# EAGLE design MJU (EAGLE 6.4)
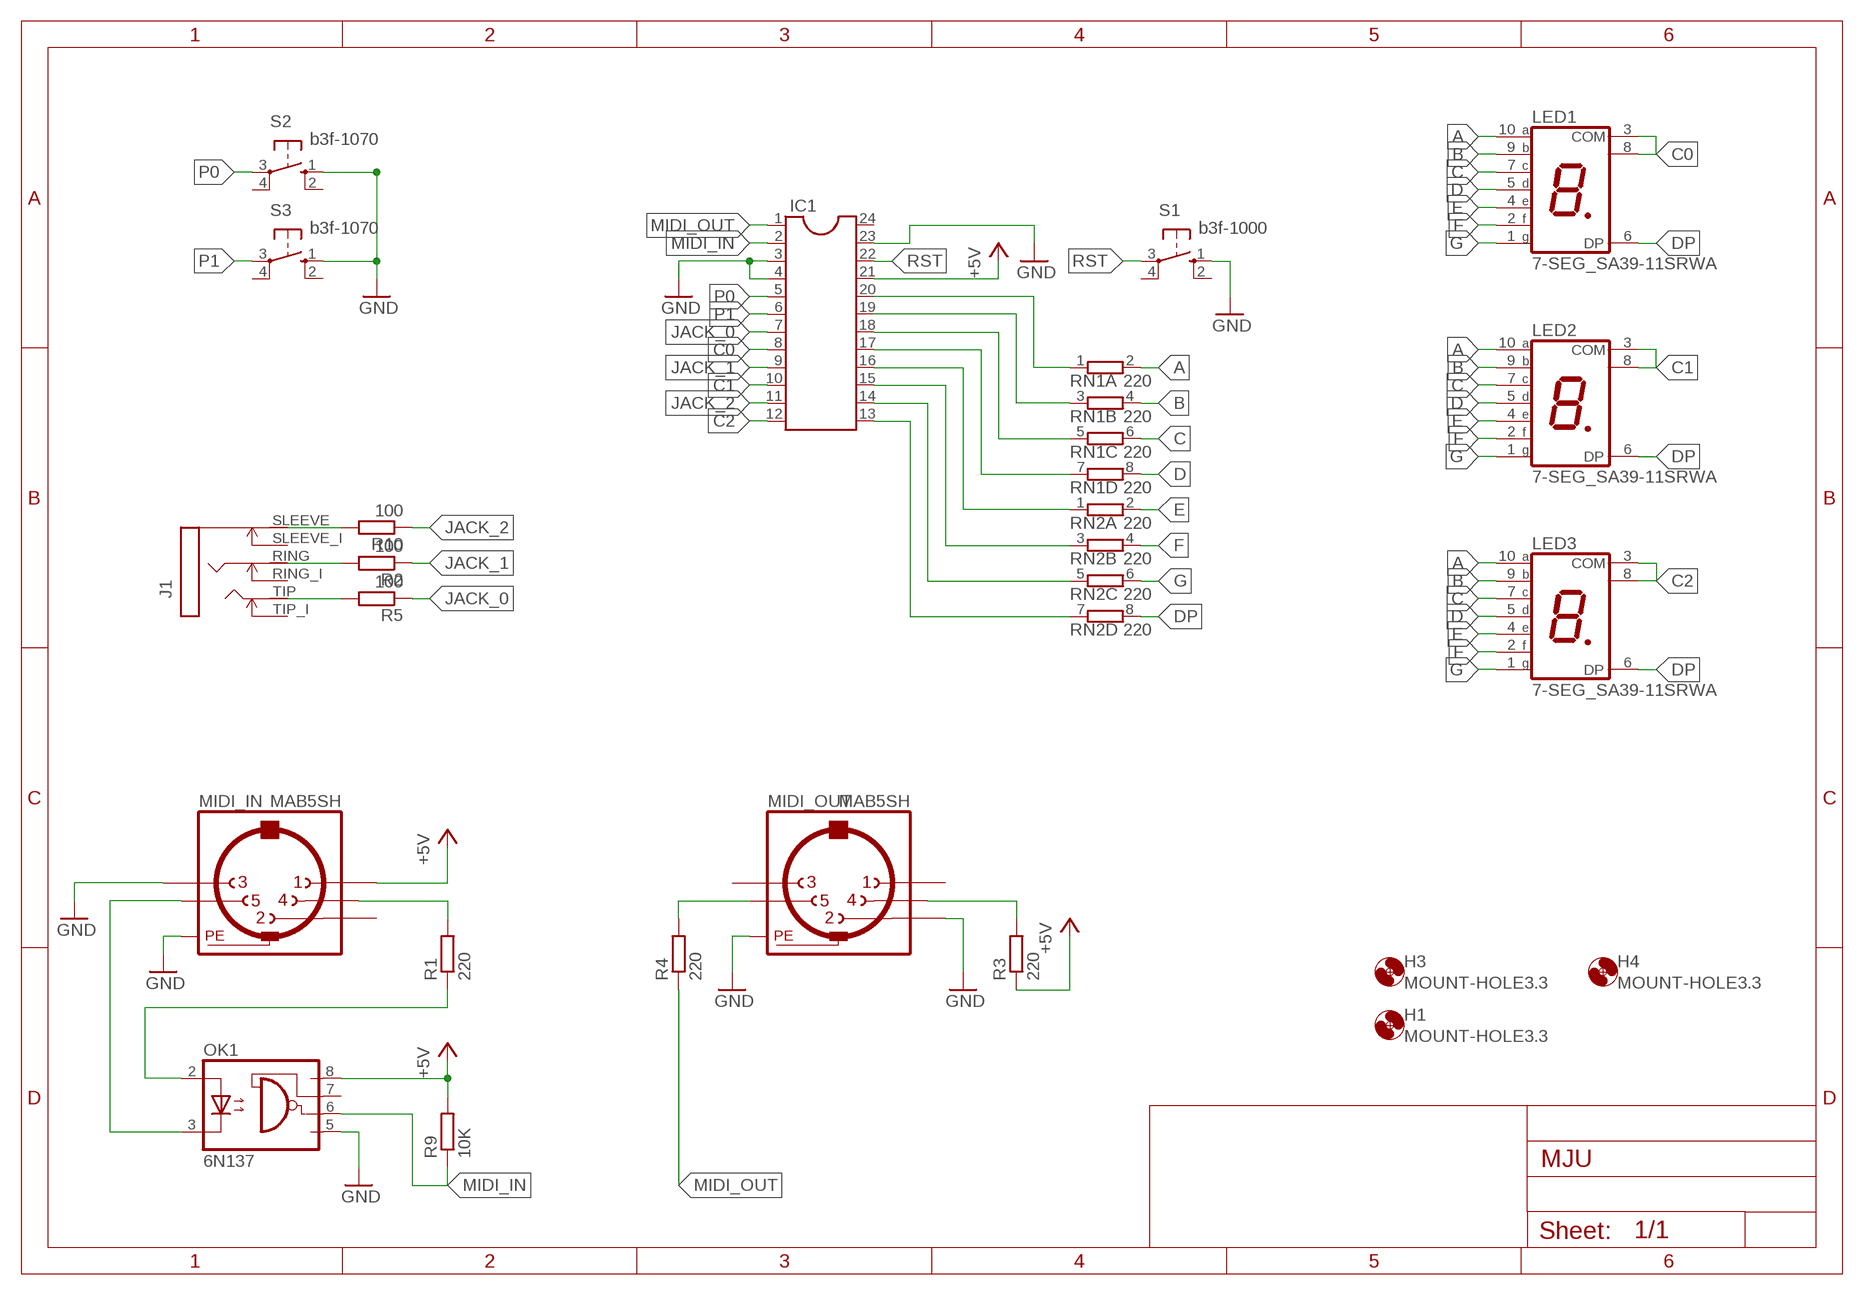
[diagram p0: schematic, sheet 1]

## Parts
H1  MOUNT-HOLE3.3  [3,3]
H3  MOUNT-HOLE3.3  [3,3]
H4  MOUNT-HOLE3.3  [3,3]
IC1  DIL24-6  [DIL24-6]
J1  STEREOSWJACK_ST_TRS_INT  [ST_JACK_TRS_INT]
LED1  7-SEG_SA39-11SRWA  [SA39-11SRWA]
LED2  7-SEG_SA39-11SRWA  [SA39-11SRWA]
LED3  7-SEG_SA39-11SRWA  [SA39-11SRWA]
MIDI_IN  MAB5SH  [MAB5SH]
MIDI_OUT  MAB5SH  [MAB5SH]
OK1  6N137  [DIL08]
R1  220  R-EU_0207/7  [0207/7]
R2  100  R-EU_0207/7  [0207/7]
R3  220  R-EU_0207/7  [0207/7]
R4  220  R-EU_0207/7  [0207/7]
R5  100  R-EU_0207/7  [0207/7]
R9  10K  R-EU_0207/7  [0207/7]
R10  100  R-EU_0207/7  [0207/7]
RN1  220  E4R  [SIL8]
RN2  220  E4R  [SIL8]
S1  b3f-1000  10-XX  [B3F-10XX]
S2  b3f-1070  10-XX  [B3F-10XX]
S3  b3f-1070  10-XX  [B3F-10XX]

## Nets
+5V [5vdc]: IC1.21 MIDI_IN.1 OK1.8(VCC) R3.1 R9.2
A: LED1.10(A) LED2.10(A) LED3.10(A) RN1.2
B: LED1.9(B) LED2.9(B) LED3.9(B) RN1.4
C: LED1.7(C) LED2.7(C) LED3.7(C) RN1.6
C0: IC1.8 LED1.3(COM) LED1.8(COM)
C1: IC1.10 LED2.3(COM) LED2.8(COM)
C2: IC1.12 LED3.3(COM) LED3.8(COM)
D: LED1.5(D) LED2.5(D) LED3.5(D) RN1.8
DP: LED1.6(DP) LED2.6(DP) LED3.6(DP) RN2.8
E: LED1.4(E) LED2.4(E) LED3.4(E) RN2.2
F: LED1.2(F) LED2.2(F) LED3.2(F) RN2.4
G: LED1.1(G) LED2.1(G) LED3.1(G) RN2.6
GND [gnd]: IC1.3 IC1.4 IC1.23 MIDI_IN.3 MIDI_IN.PE MIDI_IN.PE@(PE) MIDI_OUT.2 MIDI_OUT.PE MIDI_OUT.PE@(PE) OK1.5(GND) S1.1(S) S2.1(S) S3.1(S)
JACK_0: IC1.7 R5.1
JACK_1: IC1.9 R2.1
JACK_2: IC1.11 R10.1
MIDI_IN: IC1.2 OK1.6(VO) R9.1
MIDI_OUT: IC1.1 R4.1
N$1: J1.SLEEVE(S) R10.2
N$2: J1.RING(R) R2.2
N$4: J1.TIP(T) R5.2
N$5: MIDI_IN.5 OK1.3(C)
N$6: OK1.2(A) R1.1
N$7: MIDI_IN.4 R1.2
N$8: MIDI_OUT.5 R4.2
N$10: MIDI_OUT.4 R3.2
P0: IC1.5 S2.3(P)
P1: IC1.6 S3.3(P)
RST: IC1.22 S1.3(P)
S0: IC1.20 RN1.1
S1: IC1.19 RN1.3
S2: IC1.18 RN1.5
S3: IC1.17 RN1.7
S4: IC1.16 RN2.1
S5: IC1.15 RN2.3
S6: IC1.14 RN2.5
S7: IC1.13 RN2.7
Unconnected: IC1.24 J1.RING_I(RN) J1.SLEEVE_I(SN) J1.TIP_I(TN) MIDI_IN.2 MIDI_OUT.1 MIDI_OUT.3 OK1.7(VE) S1.2(S1) S1.4(P1) S2.2(S1) S2.4(P1) S3.2(S1) S3.4(P1)

## Library data of the parts
H1 H3 H4 = holes:MOUNT-HOLE: MOUNTING HOLE with drill center marker
IC1 = ic-package:DIL24: Dual In Line
J1 = jacks:STEREOSW
LED1-LED3 = display-kingbright:7-SEG_: Kingbright 14.2mm (0.56 INCH) SINGLE DIGIT NUMERIC DUISPLAY Source: SA56-11EWA(Ver1189471036.pdf; OC_FARNELL: unknown; OC_NEWARK: unknown
MIDI_IN MIDI_OUT = con-hirschmann:MAB5SH: Female CONNECTOR 5 pins 90 deg. with shield, horizontal (DIN 41524); OC_FARNELL: 809883; OC_NEWARK: unknown
OK1 = optocoupler:6N137: MOTOROLA OPTO COUPLER; MPN: 6N137; OC_FARNELL: 1328376; OC_NEWARK: 52M1895
R1-R5 R9 R10 = rcl:R-EU_: RESISTOR, European symbol
RN1 RN2 = resistor-sil:E4R: SIL RESISTOR; OC_FARNELL: unknown; OC_NEWARK: unknown
S1-S3 = switch-omron:10-XX: OMRON SWITCH; MPN: B3F-1000; OC_FARNELL: 176432; OC_NEWARK: 36M3542

## Net classes
0 default: width 0.254 mm, drill 0.127 mm, clearance 0.254 mm
1 5vdc: width 0.508 mm, drill 0.127 mm, clearance 0.406 mm
2 gnd: width 0.508 mm, drill 0.127 mm, clearance 0.508 mm

## Board
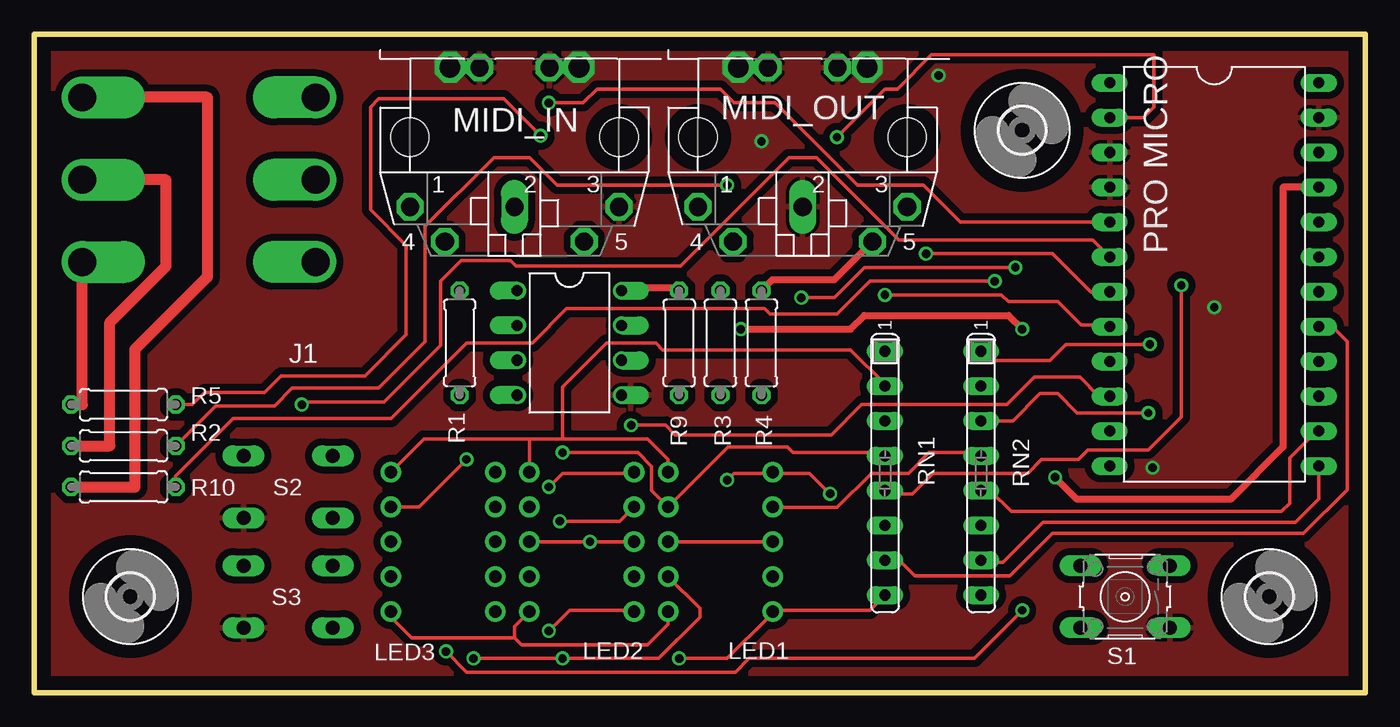
[diagram p1: board, top side]
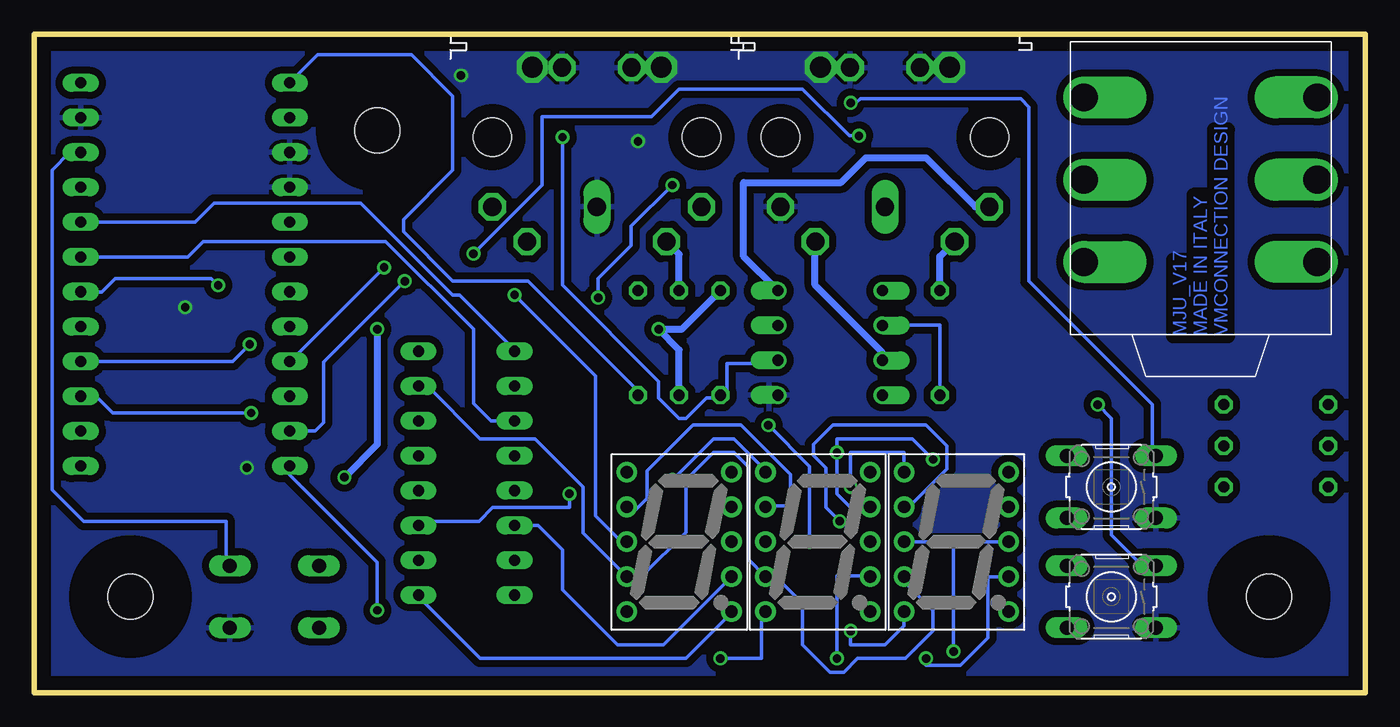
[diagram p2: board, bottom side, seen from below]

Size 97 x 48 mm. Coordinates in mm from the lower left corner, seen from the top.
Outline: 0,0 97,0 97,48 0,48 0,0
Copper layers (1*16): Top 0.035mm / dielectric 1.5mm / Bottom 0.035mm
Design rules "default": minimum track width 10mil, minimum drill 24mil, track to track 8mil, track to pad 8mil, pad to pad 8mil, via to via 8mil, smd to smd 8mil, copper to edge 40mil, drill to drill 8mil, minimum pad ring 10mil, minimum via ring 8mil, stop-mask expansion 4mil, vias tented up to drill 0mil, thermal gap 10mil

### Footprints (pad centres in the part's own frame; a part is rotated, then mirrored left to right if it is on the bottom)
3,3 = hole 3.3: 0,0
DIL24-6 = drill 0.813 long: 1 -13.97,-7.62; 2 -11.43,-7.62; 3 -8.89,-7.62; 4 -6.35,-7.62; 5 -3.81,-7.62; 6 -1.27,-7.62; 7 1.27,-7.62; 8 3.81,-7.62; 9 6.35,-7.62; 10 8.89,-7.62; 11 11.43,-7.62; 12 13.97,-7.62; 13 13.97,7.62; 14 11.43,7.62; 15 8.89,7.62; 16 6.35,7.62; 17 3.81,7.62; 18 1.27,7.62; 19 -1.27,7.62; 20 -3.81,7.62; 21 -6.35,7.62; 22 -8.89,7.62; 23 -11.43,7.62; 24 -13.97,7.62
ST_JACK_TRS_INT = drill 2.032 offset: RING 8.5,0; RING_I -8.5,0; SLEEVE 8.5,-6; SLEEVE_I -8.5,-6; TIP 8.5,6; TIP_I -8.5,6
SA39-11SRWA = drill 0.9 pad 1.5: 1 -3.81,5.08; 2 -3.81,2.54; 3 -3.81,0; 4 -3.81,-2.54; 5 -3.81,-5.08; 6 3.81,-5.08; 7 3.81,-2.54; 8 3.81,0; 9 3.81,2.54; 10 3.81,5.08
MAB5SH = drill 1.321 octagon: 1 7.62,5.08; 3 -7.62,5.08; 4 5.08,7.62; 5 -5.08,7.62; PE -2.54,-5.08; PE@ 2.54,-5.08 | drill 1.321 long: 2 0,5.08 | hole 2.794: 7.62,0; -7.62,0
DIL08 = drill 0.813 offset: 1 -3.81,-3.81; 2 -1.27,-3.81; 3 1.27,-3.81; 4 3.81,-3.81; 5 3.81,3.81; 6 1.27,3.81; 7 -1.27,3.81; 8 -3.81,3.81
0207/7 = drill 0.813 octagon: 1 -3.81,0; 2 3.81,0
SIL8 = drill 0.813 long: 1 -8.89,0; 2 -6.35,0; 3 -3.81,0; 4 -1.27,0; 5 1.27,0; 6 3.81,0; 7 6.35,0; 8 8.89,0
B3F-10XX = drill 1.016 long: 1 -3.251,2.261; 2 3.251,2.261; 3 -3.251,-2.261; 4 3.251,-2.261

### Placement (x,y rotation side)
H1  7,7 0 top
H3  72,41 0 top
H4  90,7 0 top
IC1  86,30.5 270 top
J1  12,37.4 180 top
LED1  50,11 0 bottom
LED2  39.9,11 0 bottom
LED3  29.8,11 0 bottom
MIDI_IN  35,40.5 180 top
MIDI_OUT  56,40.5 180 top
OK1  39,25.5 270 top
R1  31,25.5 90 top
R2  6.5,18 180 top
R3  50,25.5 90 top
R4  53,25.5 90 top
R5  6.5,21 180 top
R9  47,25.5 90 top
R10  6.5,15 180 top
RN1  62,16 270 top
RN2  69,16 270 top
S1  79.5,7 180 top
S2  18.5,15 180 bottom
S3  18.5,7 180 bottom

### Tracks (layer width: path | path; a pad name or v marks a point on that pad's centre or on a via)
+5V  (via drill 0.61)
  Top 0.508: OK1.8 43,29.5 47,29.5 R9.2 | v72,26.5 71,27.5 60.5,27.5 59.5,26.5 v51.5,26.5 | 74.6,15.5 v74.4,15.7 76,14.1 87.2,14.1 91,17.9 91,36.85 IC1.21
  Bottom 0.508: v72,26.5 72,18.1 v74.4,15.7 | R3.1 50,25 v51.5,26.5 49.81,26.5 R9.2 | OK1.8 45.3,31.8 45.3,37.2 38.2,37.2 36.4,39 32,39 28.42,35.42 MIDI_IN.1
A
  Top 0.254: 38.5,18.5 38.5,22.3 41.7,25.5 45.3,25.5 45.8,25 59.5,25 62,22.5 RN1.2 | 38.5,18.5 36.1,18.5 | 36.1,18.5 28.41,18.5 LED3.10 | 38.5,18.5 44.7,18.5 46.19,17.01 LED1.10 | LED2.10 36.1,18.5
B  (via drill 0.61)
  Top 0.254: RN1.4 62,17.5 55.3,17.5 54.9,17.9 50.55,17.9 LED1.9 45,14.73 45,16.5 44,17.5 v38.5,17.5 | LED3.9 28.04,13.54 v31.5,17
  Bottom 0.254: v31.5,17 33,18.5 38.5,18.5 v38.5,17.5 38.5,14.5 37.54,13.54 LED2.9
C  (via drill 0.61)
  Top 0.254: v32,2.5 v38.5,2.5 45.5,2.5 48.5,5.5 48.5,6.15 LED1.7
  Bottom 0.254: 62,12 RN1.6 60.29,12.19 58.5,10.4 58.5,7.5 54.5,3.5 51.15,3.5 LED1.7 | v32,2.5 32,2 29.5,2 27.5,4 27.5,8.46 LED3.7 | v38.5,2.5 38.5,8.5 36.5,8.5 LED2.7
C0  (via drill 0.61)
  Top 0.254: v62,29 70.5,29 71,28.5 74.6,28.5 76.3,26.8 78.27,26.8 IC1.8 | LED1.3 LED1.8
  Bottom 0.254: v62,29 56.1,23.1 56.1,12.9 54.2,11 LED1.3 54,11
C1  (via drill 0.61)
  Top 0.254: LED2.3 v40.5,11 LED2.8 | v43.5,19.5 46,19.5 46.7,18.8 58.1,18.8 60.3,21 70.9,21 72.9,23 76.2,23 77.6,21.6 IC1.10
  Bottom 0.254: v43.5,19.5 40.5,16.5 v40.5,11
C2  (via drill 0.61)
  Top 0.254: v72,6 68.5,2.5 52.1,2.5 51.1,1.5 31.5,1.5 v30,3
  Bottom 0.254: v72,6 72,9.5 78.38,15.88 IC1.12 | LED3.8 30,11 | 30,11 LED3.3 | v30,3 30,11
D  (via drill 0.61)
  Top 0.254: v37.5,4.5 39,6 43.5,6 LED2.5 | v47,2.5 50.5,2.5 53.5,5.5 LED1.5 54,6 60.89,6 RN1.8
  Bottom 0.254: v37.5,4.5 37.5,3.5 35,3.5 33.61,4.89 LED3.5 | v47,2.5 44,2.5 44,5.5 LED2.5
DP
  Top 0.254: 35,4 27.5,4 26,5.5 LED3.6 | 35,4 35.5,3.5 44.7,3.5 46.2,5 LED1.6 | 35,4 35,4.83 LED2.6
  Bottom 0.254: RN2.8 69,7 64.5,2.5 49.5,2.5 46.5,5.5 LED1.6
E
  Bottom 0.254: LED3.4 33.5,8 31.5,6 31.5,4.5 33.5,2.5 37,2.5 38,1.5 39,1.5 41,3.5 41,6.5 42.96,8.46 LED2.4 45,9.75 45,16.5 46,17.5 47.5,17.5 49.5,15.5 49.5,11.7 52.7,8.5 53.77,8.5 LED1.4 57,11.65 57,15 60.5,18.5 64.5,18.5 68.35,22.35 RN2.2
F  (via drill 0.61)
  Top 0.254: RN2.4 69,17.5 65.2,17.5 63.7,16 61,16 58.5,13.5 54,13.5 LED1.2 | v38.3,12.5 42.67,12.5 LED2.2
  Bottom 0.254: LED1.2 54,13.5 54,13 53.5,13 52.35,14.15 52.35,16.15 49,19.5 45.5,19.5 41.9,15.9 41.9,13.6 43.65,13.6 LED2.2 | LED3.2 33.26,13.54 30.5,16.3 30.5,18 32,19.5 38.8,19.5 40.2,18.1 40.2,17.3 39.3,16.4 39.3,13.5 v38.3,12.5
G  (via drill 0.61)
  Top 0.254: v37.5,15 38.5,16 43.5,16 LED2.1 | v58,14.5 56.5,16 54,16 LED1.1 53.5,16 51,16 v50.5,15.5
  Bottom 0.254: v37.5,15 37.5,17.5 33.61,17.5 LED3.1 | v58,14.5 58,13.5 63.6,13.5 64.6,12.5 68.69,12.5 RN2.6 | LED2.1 44,16.5 46,18.5 47.5,18.5 v50.5,15.5
GND  (via drill 0.6, 0.61, 1.5)
  other vias: 30.3,45.6 39.7,45.6 51.3,45.6 60.7,45.6 65.9,45 53,40.2 86,28.1 81.5,16.4
  pour Top (isolate 0.406): 0,0 97,0 97,48 0,48
  pour Bottom (isolate 0.406): 0,0 97,0 97,48 0,48
JACK_0  (via drill 0.61)
  Top 0.254: v36.9,40.6 34.2,43.3 25.1,43.3 24.5,42.7 24.5,35.2 27.1,32.6 27.1,26.1 24.1,23.1 18,23.1 16.8,21.9 12.4,21.9 11.5,21 R5.1 | v65,32 74.2,32 77,29.2 78.35,29.2 IC1.7
  Bottom 0.254: v65,32 60,37 60,42 52,42 50,44 41,44 37.6,40.6 v36.9,40.6
JACK_1  (via drill 0.61)
  Top 0.254: v50.5,37 38.1,37 36.1,39 33.5,39 28.5,34 28.5,25.6 25.1,22.2 18.8,22.2 17.5,20.9 13.21,20.9 R2.1 | v71.5,31 60.5,31 58.3,28.8 v55.9,28.8
  Bottom 0.254: v50.5,37 53.5,34 53.5,32.6 55.9,30.2 v55.9,28.8 | v71.5,31 78.35,24.15 IC1.9
JACK_2  (via drill 0.61)
  Top 0.254: v70,30 60.9,30 58.5,27.6 53.6,27.6 53.2,28 38.8,28 36.3,25.5 31.5,25.5 26,20 14.5,20 10.31,15.81 R10.1
  Bottom 0.254: v70,30 75.9,24.1 75.9,19.7 76.53,19.07 IC1.11
MIDI_IN  (via drill 0.61)
  Top 0.254: v58.5,40.5 62,44 62.9,44 65.4,46.5 81.6,46.5 81.6,42.7 80.83,41.93 IC1.2
  Bottom 0.254: 47,21.5 46.5,22 46.5,24 43,24 OK1.6 | v58.5,40.5 58.5,29.7 51.5,22.7 51.5,21.5 50,20 49.5,20 48,21.5 47,21.5 | 47,21.5 R9.1
MIDI_OUT
  Bottom 0.254: R4.1 53,22 61,30 66.5,30 70.1,33.6 70.1,34.5 66.5,38.1 66.5,43.5 69.5,46.5 76.35,46.5 IC1.1
N$1
  Top 0.813: R10.2 7.35,15 7.35,25.05 12.6,30.3 12.6,43.4 J1.SLEEVE
N$2
  Top 0.813: R2.2 5.5,18 5.5,27 9.6,31.1 9.6,37.4 J1.RING
N$4
  Top 0.813: R5.2 3.5,21 J1.TIP
N$5
  Bottom 0.508: OK1.3 35.19,24.79 40.1,29.7 40.1,32.86 MIDI_IN.5
N$6
  Bottom 0.254: 31,22 R1.1 31,26.8 35.16,26.8 OK1.2
N$7
  Bottom 0.508: R1.2 31,31.8 MIDI_IN.4
N$8
  Top 0.508: MIDI_OUT.5 58.3,30.1 53.79,30.1 R4.2
N$10
  Bottom 0.508: R3.2 50,31.96 MIDI_OUT.4
P0  (via drill 0.61)
  Top 0.254: v37.5,43 40,43 41,44 50,44 51,43 54,43 60,37 64.8,37 67.49,34.31 IC1.5
  Bottom 0.254: S2.3 15.5,17.5 15.5,21 24.5,30 24.5,42.7 25.1,43.3 36.8,43.3 37.1,43 v37.5,43
P1  (via drill 0.61)
  Top 0.254: v19.5,21 19.7,21.2 25.5,21.2 29.6,25.3 29.6,30 31.1,31.5 34.7,31.5 35.1,31.1 47.1,31.1 55,39 57,39 63,33 77.15,33 IC1.6
  Bottom 0.254: v19.5,21 18.5,20 18.5,11.5 16.5,9.5 15.5,9.5 S3.3
RST
  Bottom 0.254: S1.3 83,9.5 83,12.5 93.4,12.5 95.7,14.8 95.7,38.1 94.4,39.4 IC1.22
S0
  Bottom 0.254: RN1.1 62,25 66,29 66.5,29 73.2,35.7 83.9,35.7 85.29,34.31 IC1.20
S1
  Bottom 0.254: RN1.3 63.71,19.81 65,21.1 65,26.5 71.4,32.9 84.7,32.9 85.83,31.77 IC1.19
S2  (via drill 0.6)
  Top 0.254: RN1.5 62,14.5 64,14.5 65.5,16 72.4,16 73.4,17 76.1,17 76.8,17.7 81.2,17.7 83.6,20.1 v83.6,29.7
  Bottom 0.254: v83.6,29.7 84.1,30.2 91.1,30.2 92.1,29.2 93.59,29.2 IC1.18
S3
  Top 0.254: RN1.7 62,9.5 63.2,9.5 64.2,8.5 71.1,8.5 74.2,11.6 92.5,11.6 95.7,14.8 95.7,25.6 94.6,26.7 IC1.17
S4  (via drill 0.6)
  Top 0.254: RN2.1 69.69,24.2 74,24.2 75.2,25.4 v81.3,25.4
  Bottom 0.254: v81.3,25.4 82.55,24.15 IC1.16
S5  (via drill 0.6)
  Top 0.254: 69,20 RN2.3 71.31,19.81 73.3,21.8 74.6,21.8 76,20.4 v81.2,20.4
  Bottom 0.254: v81.2,20.4 91.3,20.4 92.5,21.6 IC1.15
S6
  Top 0.254: IC1.14 93.47,19.07 91.5,17.1 91.5,13.8 90.9,13.2 71.2,13.2 69.7,14.7 69.03,14.7 RN2.5
S7
  Top 0.254: RN2.7 69,9.5 70.6,9.5 73.5,12.4 91.9,12.4 93.62,14.12 IC1.13

### Text on the board
Bottom: VMCONNECTION DESIGN | MADE IN ITALY | MJU_V17
tNames: PRO MICRO